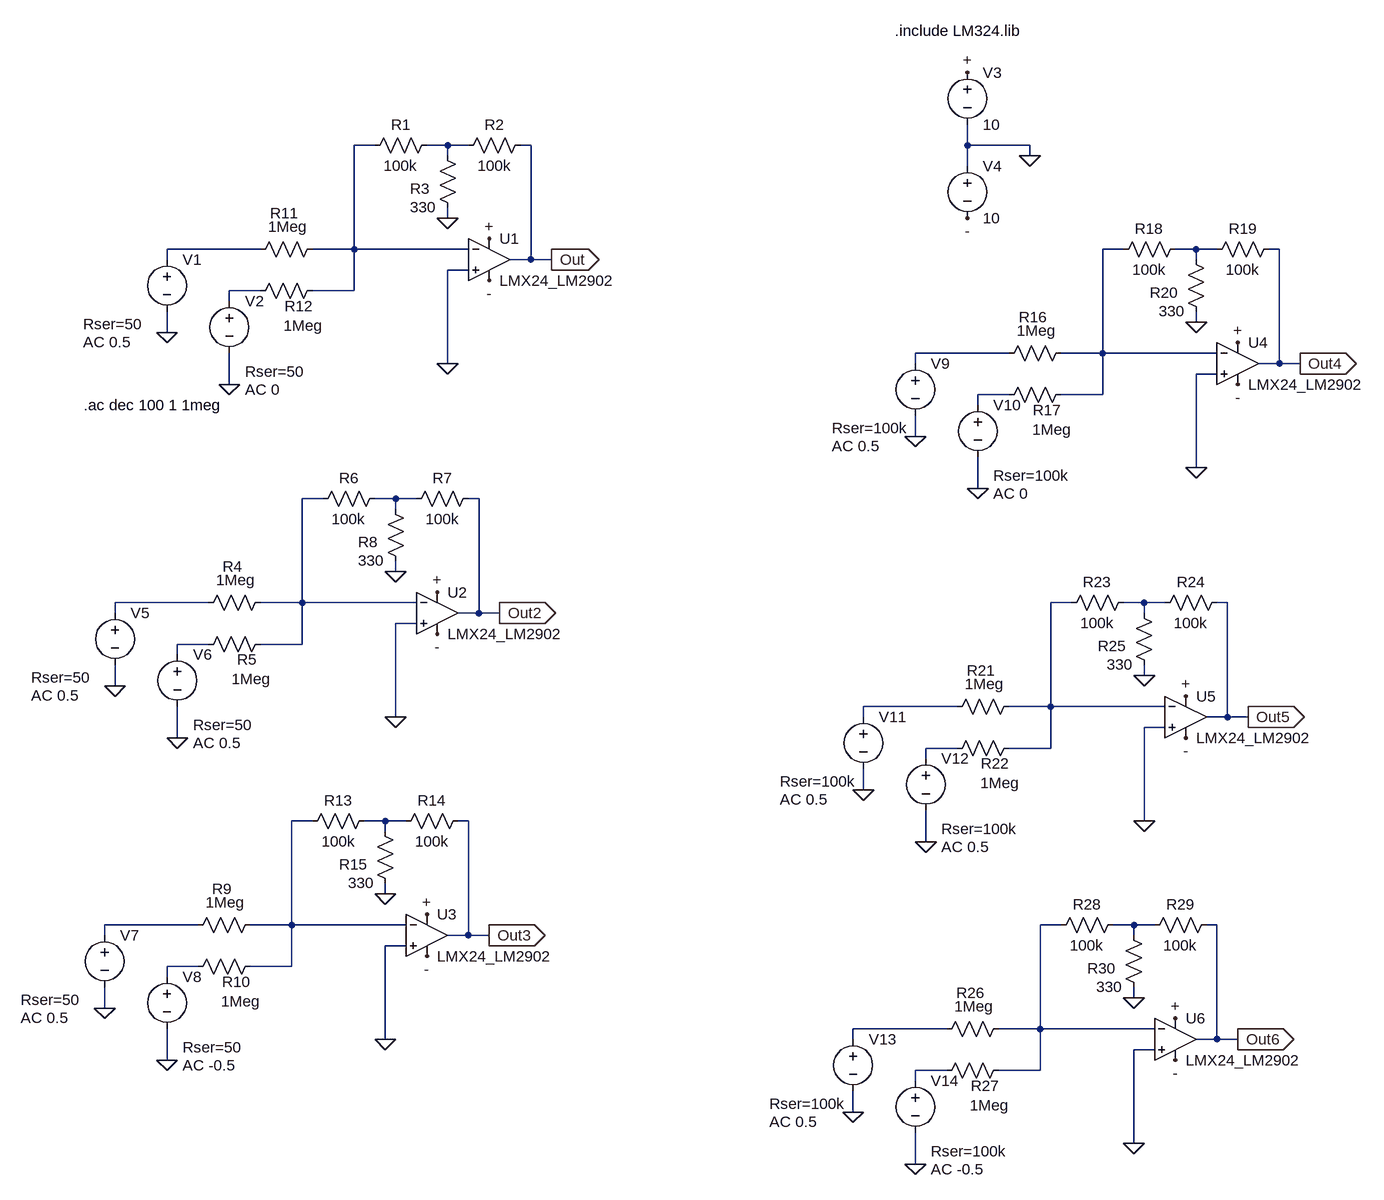
[diagram p0: schematic circuito_bode.asc]
circuito_bode.asc, the LTspice schematic file:
Version 4.1
SHEET 1 1556 1528
WIRE 16 -64 -16 -64
WIRE 128 -64 96 -64
WIRE 160 -64 128 -64
WIRE 256 -64 240 -64
WIRE 928 -64 928 -96
WIRE 1024 -64 928 -64
WIRE 128 -48 128 -64
WIRE 1024 -48 1024 -64
WIRE 928 -32 928 -64
WIRE 128 48 128 32
WIRE -160 96 -304 96
WIRE -16 96 -16 -64
WIRE -16 96 -80 96
WIRE 160 96 -16 96
WIRE 1168 96 1136 96
WIRE 1280 96 1248 96
WIRE 1312 96 1280 96
WIRE 1408 96 1392 96
WIRE -304 112 -304 96
WIRE 256 112 256 -64
WIRE 256 112 224 112
WIRE 288 112 256 112
WIRE 1280 112 1280 96
WIRE 160 128 128 128
WIRE -160 160 -208 160
WIRE -16 160 -16 96
WIRE -16 160 -80 160
WIRE -208 176 -208 160
WIRE 1280 208 1280 192
WIRE -304 224 -304 192
WIRE 992 256 848 256
WIRE 1136 256 1136 96
WIRE 1136 256 1072 256
WIRE 1312 256 1136 256
WIRE 128 272 128 128
WIRE 848 272 848 256
WIRE 1408 272 1408 96
WIRE 1408 272 1376 272
WIRE 1440 272 1408 272
WIRE 1312 288 1280 288
WIRE -208 304 -208 256
WIRE 992 320 944 320
WIRE 1136 320 1136 256
WIRE 1136 320 1072 320
WIRE 944 336 944 320
WIRE 848 384 848 352
WIRE 1280 432 1280 288
WIRE 944 464 944 416
WIRE -64 480 -96 480
WIRE 48 480 16 480
WIRE 80 480 48 480
WIRE 176 480 160 480
WIRE 48 496 48 480
WIRE 48 592 48 576
WIRE -240 640 -384 640
WIRE -96 640 -96 480
WIRE -96 640 -160 640
WIRE 80 640 -96 640
WIRE 1088 640 1056 640
WIRE 1200 640 1168 640
WIRE 1232 640 1200 640
WIRE 1328 640 1312 640
WIRE -384 656 -384 640
WIRE 176 656 176 480
WIRE 176 656 144 656
WIRE 208 656 176 656
WIRE 1200 656 1200 640
WIRE 80 672 48 672
WIRE -240 704 -288 704
WIRE -96 704 -96 640
WIRE -96 704 -160 704
WIRE -288 720 -288 704
WIRE 1200 752 1200 736
WIRE -384 768 -384 736
WIRE 912 800 768 800
WIRE 1056 800 1056 640
WIRE 1056 800 992 800
WIRE 1232 800 1056 800
WIRE 48 816 48 672
WIRE 768 816 768 800
WIRE 1328 816 1328 640
WIRE 1328 816 1296 816
WIRE 1360 816 1328 816
WIRE 1232 832 1200 832
WIRE -288 848 -288 800
WIRE 912 864 864 864
WIRE 1056 864 1056 800
WIRE 1056 864 992 864
WIRE 864 880 864 864
WIRE 768 928 768 896
WIRE -80 976 -112 976
WIRE 32 976 0 976
WIRE 64 976 32 976
WIRE 160 976 144 976
WIRE 1200 976 1200 832
WIRE 32 992 32 976
WIRE 864 1008 864 960
WIRE 32 1088 32 1072
WIRE -256 1136 -400 1136
WIRE -112 1136 -112 976
WIRE -112 1136 -176 1136
WIRE 64 1136 -112 1136
WIRE 1072 1136 1040 1136
WIRE 1184 1136 1152 1136
WIRE 1216 1136 1184 1136
WIRE 1312 1136 1296 1136
WIRE -400 1152 -400 1136
WIRE 160 1152 160 976
WIRE 160 1152 128 1152
WIRE 192 1152 160 1152
WIRE 1184 1152 1184 1136
WIRE 64 1168 32 1168
WIRE -256 1200 -304 1200
WIRE -112 1200 -112 1136
WIRE -112 1200 -176 1200
WIRE -304 1216 -304 1200
WIRE 1184 1248 1184 1232
WIRE -400 1264 -400 1232
WIRE 896 1296 752 1296
WIRE 1040 1296 1040 1136
WIRE 1040 1296 976 1296
WIRE 1216 1296 1040 1296
WIRE 32 1312 32 1168
WIRE 752 1312 752 1296
WIRE 1312 1312 1312 1136
WIRE 1312 1312 1280 1312
WIRE 1344 1312 1312 1312
WIRE 1216 1328 1184 1328
WIRE -304 1344 -304 1296
WIRE 896 1360 848 1360
WIRE 1040 1360 1040 1296
WIRE 1040 1360 976 1360
WIRE 848 1376 848 1360
WIRE 752 1424 752 1392
WIRE 1184 1472 1184 1328
WIRE 848 1504 848 1456
FLAG 288 112 Out
IOPIN 288 112 Out
FLAG 192 80 +
FLAG 192 144 -
FLAG 928 -176 +
FLAG 928 48 -
FLAG -304 224 0
FLAG -208 304 0
FLAG 1024 -48 0
FLAG 128 48 0
FLAG 128 272 0
FLAG 208 656 Out2
IOPIN 208 656 Out
FLAG 112 624 +
FLAG 112 688 -
FLAG -384 768 0
FLAG -288 848 0
FLAG 48 592 0
FLAG 48 816 0
FLAG 192 1152 Out3
IOPIN 192 1152 Out
FLAG 96 1120 +
FLAG 96 1184 -
FLAG -400 1264 0
FLAG -304 1344 0
FLAG 32 1088 0
FLAG 32 1312 0
FLAG 1440 272 Out4
IOPIN 1440 272 Out
FLAG 1344 240 +
FLAG 1344 304 -
FLAG 848 384 0
FLAG 944 464 0
FLAG 1280 208 0
FLAG 1280 432 0
FLAG 1360 816 Out5
IOPIN 1360 816 Out
FLAG 1264 784 +
FLAG 1264 848 -
FLAG 768 928 0
FLAG 864 1008 0
FLAG 1200 752 0
FLAG 1200 976 0
FLAG 1344 1312 Out6
IOPIN 1344 1312 Out
FLAG 1248 1280 +
FLAG 1248 1344 -
FLAG 752 1424 0
FLAG 848 1504 0
FLAG 1184 1248 0
FLAG 1184 1472 0
SYMBOL OpAmps\\opamp2 192 48 R0
SYMATTR InstName U1
SYMATTR Value LMX24_LM2902
SYMBOL res -64 80 R90
WINDOW 0 -24 59 VBottom 2
WINDOW 3 -3 54 VBottom 2
SYMATTR InstName R11
SYMATTR Value 1Meg
SYMBOL res -64 144 R90
WINDOW 0 55 37 VBottom 2
WINDOW 3 85 30 VBottom 2
SYMATTR InstName R12
SYMATTR Value 1Meg
SYMBOL voltage 928 -192 R0
WINDOW 123 0 0 Left 0
WINDOW 39 0 0 Left 0
SYMATTR InstName V3
SYMATTR Value 10
SYMBOL voltage 928 -48 R0
WINDOW 123 0 0 Left 0
WINDOW 39 0 0 Left 0
SYMATTR InstName V4
SYMATTR Value 10
SYMBOL res 112 -80 R90
WINDOW 0 0 56 VBottom 2
WINDOW 3 32 56 VTop 2
SYMATTR InstName R1
SYMATTR Value 100k
SYMBOL res 256 -80 R90
WINDOW 0 0 56 VBottom 2
WINDOW 3 32 56 VTop 2
SYMATTR InstName R2
SYMATTR Value 100k
SYMBOL res 144 48 R180
WINDOW 0 43 45 Left 2
WINDOW 3 33 17 Left 2
SYMATTR InstName R3
SYMATTR Value 330
SYMBOL voltage -304 96 R0
WINDOW 3 -92 76 Left 2
WINDOW 123 -129 143 Left 2
WINDOW 39 -129 115 Left 2
SYMATTR InstName V1
SYMATTR Value ""
SYMATTR Value2 AC 0.5
SYMATTR SpiceLine Rser=50
SYMBOL voltage -208 160 R0
WINDOW 123 24 152 Left 2
WINDOW 39 24 124 Left 2
SYMATTR InstName V2
SYMATTR Value ""
SYMATTR Value2 AC 0
SYMATTR SpiceLine Rser=50
SYMBOL OpAmps\\opamp2 112 592 R0
SYMATTR InstName U2
SYMATTR Value LMX24_LM2902
SYMBOL res -144 624 R90
WINDOW 0 -24 59 VBottom 2
WINDOW 3 -3 54 VBottom 2
SYMATTR InstName R4
SYMATTR Value 1Meg
SYMBOL res -144 688 R90
WINDOW 0 55 37 VBottom 2
WINDOW 3 85 30 VBottom 2
SYMATTR InstName R5
SYMATTR Value 1Meg
SYMBOL res 32 464 R90
WINDOW 0 0 56 VBottom 2
WINDOW 3 32 56 VTop 2
SYMATTR InstName R6
SYMATTR Value 100k
SYMBOL res 176 464 R90
WINDOW 0 0 56 VBottom 2
WINDOW 3 32 56 VTop 2
SYMATTR InstName R7
SYMATTR Value 100k
SYMBOL res 64 592 R180
WINDOW 0 43 45 Left 2
WINDOW 3 33 17 Left 2
SYMATTR InstName R8
SYMATTR Value 330
SYMBOL voltage -384 640 R0
WINDOW 3 -92 76 Left 2
WINDOW 123 -129 143 Left 2
WINDOW 39 -129 115 Left 2
SYMATTR InstName V5
SYMATTR Value ""
SYMATTR Value2 AC 0.5
SYMATTR SpiceLine Rser=50
SYMBOL voltage -288 704 R0
WINDOW 123 24 152 Left 2
WINDOW 39 24 124 Left 2
SYMATTR InstName V6
SYMATTR Value ""
SYMATTR Value2 AC 0.5
SYMATTR SpiceLine Rser=50
SYMBOL OpAmps\\opamp2 96 1088 R0
SYMATTR InstName U3
SYMATTR Value LMX24_LM2902
SYMBOL res -160 1120 R90
WINDOW 0 -24 59 VBottom 2
WINDOW 3 -3 54 VBottom 2
SYMATTR InstName R9
SYMATTR Value 1Meg
SYMBOL res -160 1184 R90
WINDOW 0 55 37 VBottom 2
WINDOW 3 85 30 VBottom 2
SYMATTR InstName R10
SYMATTR Value 1Meg
SYMBOL res 16 960 R90
WINDOW 0 0 56 VBottom 2
WINDOW 3 32 56 VTop 2
SYMATTR InstName R13
SYMATTR Value 100k
SYMBOL res 160 960 R90
WINDOW 0 0 56 VBottom 2
WINDOW 3 32 56 VTop 2
SYMATTR InstName R14
SYMATTR Value 100k
SYMBOL res 48 1088 R180
WINDOW 0 43 45 Left 2
WINDOW 3 33 17 Left 2
SYMATTR InstName R15
SYMATTR Value 330
SYMBOL voltage -400 1136 R0
WINDOW 3 -92 76 Left 2
WINDOW 123 -129 143 Left 2
WINDOW 39 -129 115 Left 2
SYMATTR InstName V7
SYMATTR Value ""
SYMATTR Value2 AC 0.5
SYMATTR SpiceLine Rser=50
SYMBOL voltage -304 1200 R0
WINDOW 123 24 152 Left 2
WINDOW 39 24 124 Left 2
SYMATTR InstName V8
SYMATTR Value ""
SYMATTR Value2 AC -0.5
SYMATTR SpiceLine Rser=50
SYMBOL OpAmps\\opamp2 1344 208 R0
SYMATTR InstName U4
SYMATTR Value LMX24_LM2902
SYMBOL res 1088 240 R90
WINDOW 0 -24 59 VBottom 2
WINDOW 3 -3 54 VBottom 2
SYMATTR InstName R16
SYMATTR Value 1Meg
SYMBOL res 1088 304 R90
WINDOW 0 55 37 VBottom 2
WINDOW 3 85 30 VBottom 2
SYMATTR InstName R17
SYMATTR Value 1Meg
SYMBOL res 1264 80 R90
WINDOW 0 0 56 VBottom 2
WINDOW 3 32 56 VTop 2
SYMATTR InstName R18
SYMATTR Value 100k
SYMBOL res 1408 80 R90
WINDOW 0 0 56 VBottom 2
WINDOW 3 32 56 VTop 2
SYMATTR InstName R19
SYMATTR Value 100k
SYMBOL res 1296 208 R180
WINDOW 0 43 45 Left 2
WINDOW 3 33 17 Left 2
SYMATTR InstName R20
SYMATTR Value 330
SYMBOL voltage 848 256 R0
WINDOW 3 -92 76 Left 2
WINDOW 123 -129 143 Left 2
WINDOW 39 -129 115 Left 2
SYMATTR InstName V9
SYMATTR Value ""
SYMATTR Value2 AC 0.5
SYMATTR SpiceLine Rser=100k
SYMBOL voltage 944 320 R0
WINDOW 123 24 152 Left 2
WINDOW 39 24 124 Left 2
SYMATTR InstName V10
SYMATTR Value ""
SYMATTR Value2 AC 0
SYMATTR SpiceLine Rser=100k
SYMBOL OpAmps\\opamp2 1264 752 R0
SYMATTR InstName U5
SYMATTR Value LMX24_LM2902
SYMBOL res 1008 784 R90
WINDOW 0 -24 59 VBottom 2
WINDOW 3 -3 54 VBottom 2
SYMATTR InstName R21
SYMATTR Value 1Meg
SYMBOL res 1008 848 R90
WINDOW 0 55 37 VBottom 2
WINDOW 3 85 30 VBottom 2
SYMATTR InstName R22
SYMATTR Value 1Meg
SYMBOL res 1184 624 R90
WINDOW 0 0 56 VBottom 2
WINDOW 3 32 56 VTop 2
SYMATTR InstName R23
SYMATTR Value 100k
SYMBOL res 1328 624 R90
WINDOW 0 0 56 VBottom 2
WINDOW 3 32 56 VTop 2
SYMATTR InstName R24
SYMATTR Value 100k
SYMBOL res 1216 752 R180
WINDOW 0 43 45 Left 2
WINDOW 3 33 17 Left 2
SYMATTR InstName R25
SYMATTR Value 330
SYMBOL voltage 768 800 R0
WINDOW 3 -92 76 Left 2
WINDOW 123 -129 143 Left 2
WINDOW 39 -129 115 Left 2
SYMATTR InstName V11
SYMATTR Value ""
SYMATTR Value2 AC 0.5
SYMATTR SpiceLine Rser=100k
SYMBOL voltage 864 864 R0
WINDOW 123 24 152 Left 2
WINDOW 39 24 124 Left 2
SYMATTR InstName V12
SYMATTR Value ""
SYMATTR Value2 AC 0.5
SYMATTR SpiceLine Rser=100k
SYMBOL OpAmps\\opamp2 1248 1248 R0
SYMATTR InstName U6
SYMATTR Value LMX24_LM2902
SYMBOL res 992 1280 R90
WINDOW 0 -24 59 VBottom 2
WINDOW 3 -3 54 VBottom 2
SYMATTR InstName R26
SYMATTR Value 1Meg
SYMBOL res 992 1344 R90
WINDOW 0 55 37 VBottom 2
WINDOW 3 85 30 VBottom 2
SYMATTR InstName R27
SYMATTR Value 1Meg
SYMBOL res 1168 1120 R90
WINDOW 0 0 56 VBottom 2
WINDOW 3 32 56 VTop 2
SYMATTR InstName R28
SYMATTR Value 100k
SYMBOL res 1312 1120 R90
WINDOW 0 0 56 VBottom 2
WINDOW 3 32 56 VTop 2
SYMATTR InstName R29
SYMATTR Value 100k
SYMBOL res 1200 1248 R180
WINDOW 0 43 45 Left 2
WINDOW 3 33 17 Left 2
SYMATTR InstName R30
SYMATTR Value 330
SYMBOL voltage 752 1296 R0
WINDOW 3 -92 76 Left 2
WINDOW 123 -129 143 Left 2
WINDOW 39 -129 115 Left 2
SYMATTR InstName V13
SYMATTR Value ""
SYMATTR Value2 AC 0.5
SYMATTR SpiceLine Rser=100k
SYMBOL voltage 848 1360 R0
WINDOW 123 24 152 Left 2
WINDOW 39 24 124 Left 2
SYMATTR InstName V14
SYMATTR Value ""
SYMATTR Value2 AC -0.5
SYMATTR SpiceLine Rser=100k
TEXT 816 -240 Left 2 !.include LM324.lib
TEXT -432 336 Left 2 !.ac dec 100 1 1meg

The netlist it stands for:
* circuito_bode.asc
X§U1 0 N001 + - Out LMX24_LM2902  ; pins In+ In- V+ V- OUT
R11 N001 N003 1Meg
R12 N001 N006 1Meg
V3 + 0 10
V4 0 - 10
R1 N002 N001 100k
R2 Out N002 100k
R3 0 N002 330
V1 N003 0 AC 0.5 Rser=50
V2 N006 0 AC 0 Rser=50
X§U2 0 N009 + - Out2 LMX24_LM2902  ; pins In+ In- V+ V- OUT
R4 N009 N011 1Meg
R5 N009 N014 1Meg
R6 N010 N009 100k
R7 Out2 N010 100k
R8 0 N010 330
V5 N011 0 AC 0.5 Rser=50
V6 N014 0 AC 0.5 Rser=50
X§U3 0 N017 + - Out3 LMX24_LM2902  ; pins In+ In- V+ V- OUT
R9 N017 N019 1Meg
R10 N017 N022 1Meg
R13 N018 N017 100k
R14 Out3 N018 100k
R15 0 N018 330
V7 N019 0 AC 0.5 Rser=50
V8 N022 0 AC -0.5 Rser=50
X§U4 0 N004 + - Out4 LMX24_LM2902  ; pins In+ In- V+ V- OUT
R16 N004 N007 1Meg
R17 N004 N008 1Meg
R18 N005 N004 100k
R19 Out4 N005 100k
R20 0 N005 330
V9 N007 0 AC 0.5 Rser=100k
V10 N008 0 AC 0 Rser=100k
X§U5 0 N012 + - Out5 LMX24_LM2902  ; pins In+ In- V+ V- OUT
R21 N012 N015 1Meg
R22 N012 N016 1Meg
R23 N013 N012 100k
R24 Out5 N013 100k
R25 0 N013 330
V11 N015 0 AC 0.5 Rser=100k
V12 N016 0 AC 0.5 Rser=100k
X§U6 0 N020 + - Out6 LMX24_LM2902  ; pins In+ In- V+ V- OUT
R26 N020 N023 1Meg
R27 N020 N024 1Meg
R28 N021 N020 100k
R29 Out6 N021 100k
R30 0 N021 330
V13 N023 0 AC 0.5 Rser=100k
V14 N024 0 AC -0.5 Rser=100k
.include LM324.lib
.ac dec 100 1 1meg
.backanno
.end